# EAGLE design 1u_panel_v1.1 (EAGLE 7.7.0)
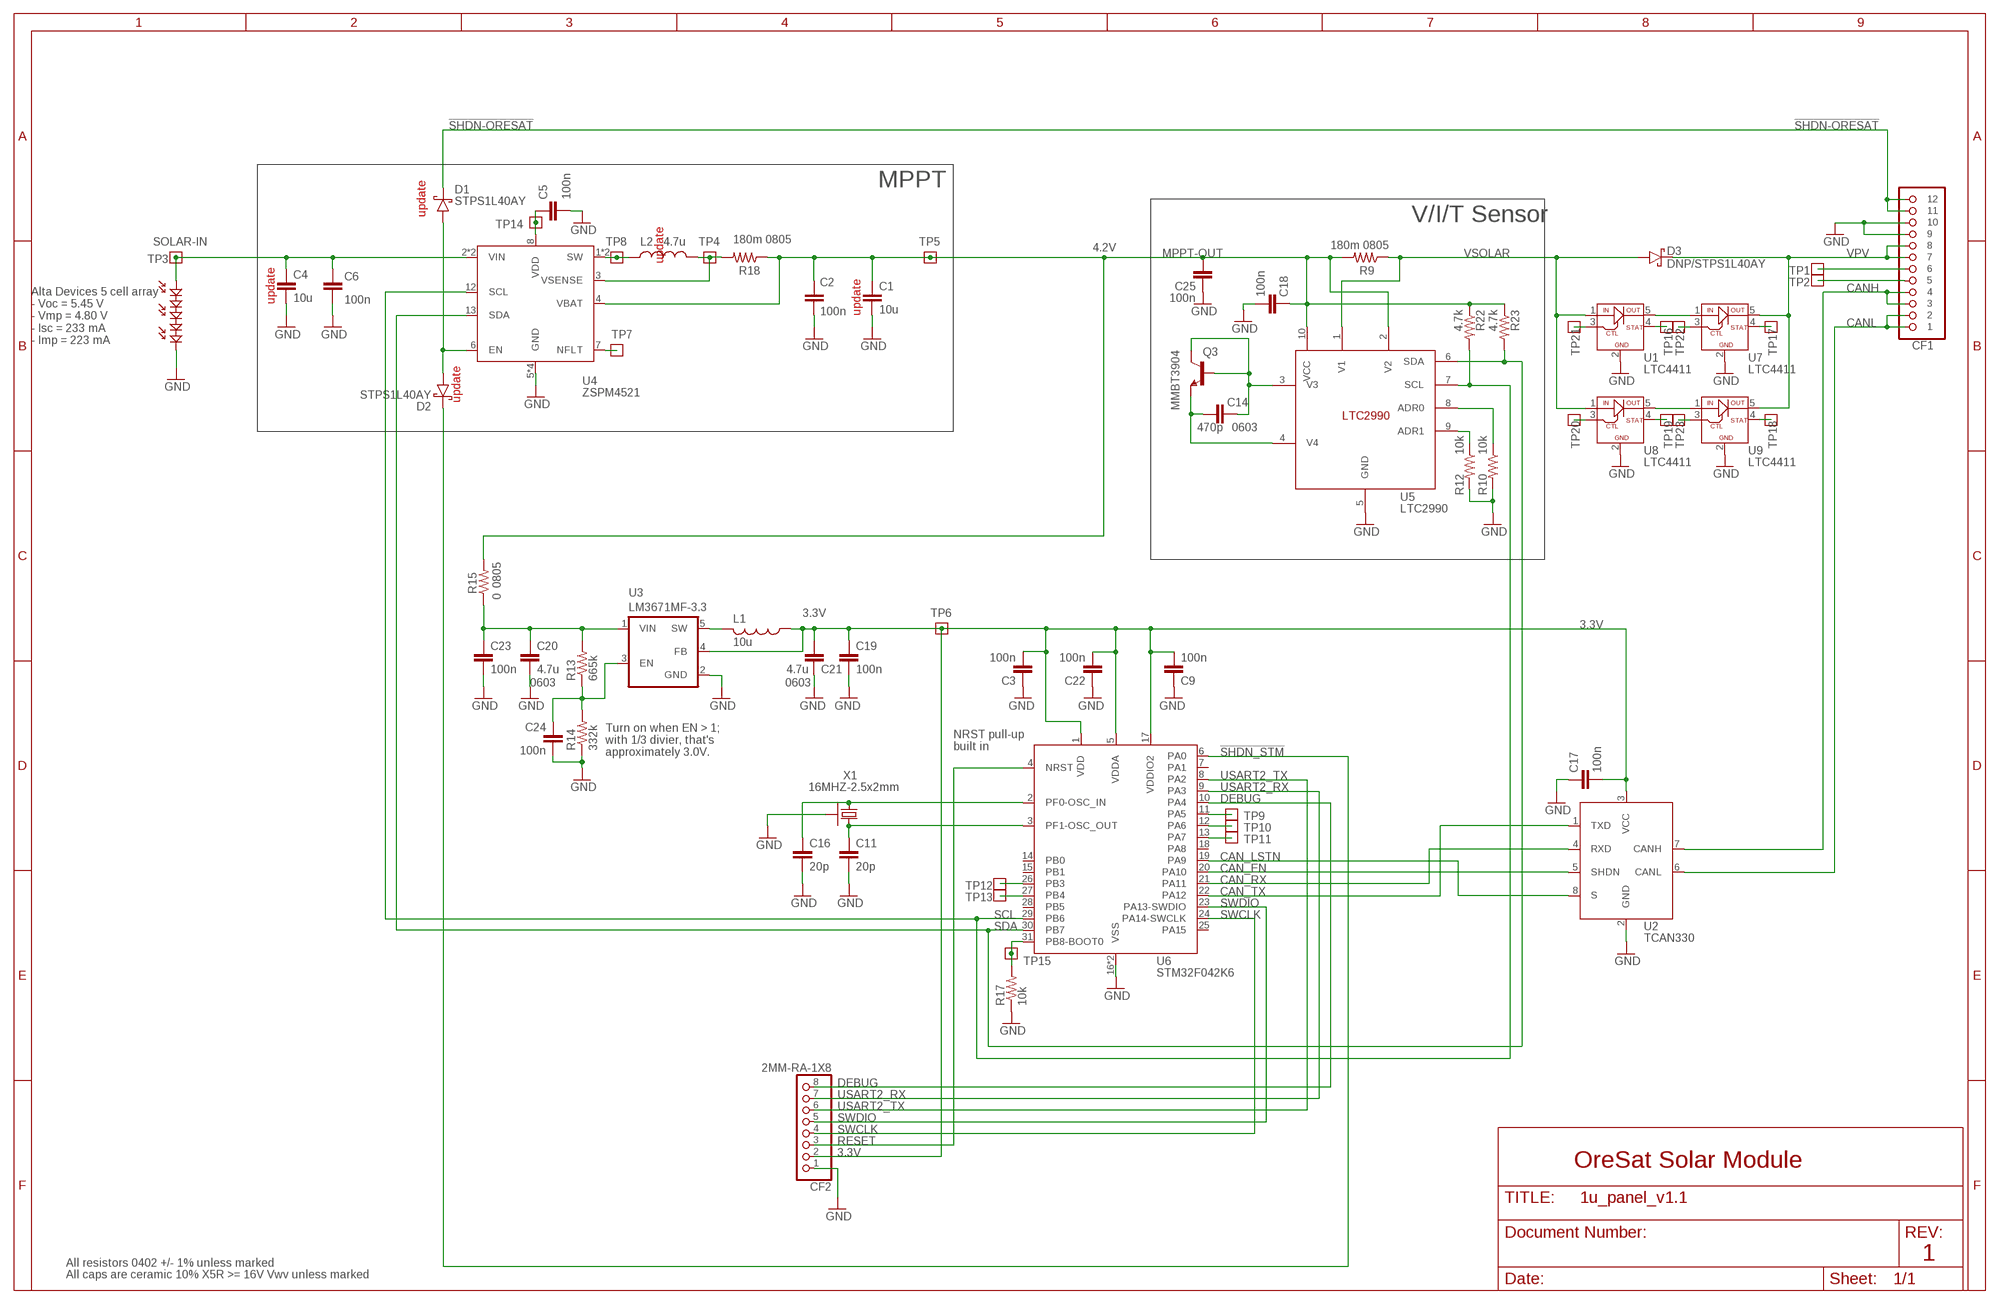
[diagram p0: schematic, sheet 1]

## Parts
C1  10u  C-EU1206-B  [1206-B]
C2  100n  C-EU0402-B-NOSILK  [.0402-B-NOSILK]
C3  100n  C-EU0402-B-NOSILK  [.0402-B-NOSILK]
C4  10u  C-EU1206-B  [1206-B]
C5  100n  C-EU0402-B-NOSILK  [.0402-B-NOSILK]
C6  100n  C-EU0402-B-NOSILK  [.0402-B-NOSILK]
C9  100n  C-EU0402-B-NOSILK  [.0402-B-NOSILK]
C11  20p  C-EU0402-B-NOSILK  [.0402-B-NOSILK]
C14  470p  C-EU0603-B-NOSILK  [.0603-B-NOSILK]
C16  20p  C-EU0402-B-NOSILK  [.0402-B-NOSILK]
C17  100n  C-EU0402-B-NOSILK  [.0402-B-NOSILK]
C18  100n  C-EU0402-B-NOSILK  [.0402-B-NOSILK]
C19  100n  C-EU0402-B-NOSILK  [.0402-B-NOSILK]
C20  4.7u  C-EUC0603  [C0603]
C21  4.7u  C-EUC0603  [C0603]
C22  100n  C-EU0402-B-NOSILK  [.0402-B-NOSILK]
C23  100n  C-EU0402-B-NOSILK  [.0402-B-NOSILK]
C24  100n  C-EU0402-B-NOSILK  [.0402-B-NOSILK]
C25  100n  C-EU0402-B-NOSILK  [.0402-B-NOSILK]
CF1  15220122401000  ORESAT-SOLARPANEL-12PIN  [CON-1.27-F-HARTING-1522012X601XXX]
CF2  2MM-RA-1X8  [CF-2MM-RA-1X8-PRECIDIP-831]
D1  STPS1L40AY  DIODE-DO214AC  [DO214AC]
D2  STPS1L40AY  DIODE-DO214AC  [DO214AC]
D3  DNP/STPS1L40AY  DIODE-DO214AC  [DO214AC]
L1  10u  L-USL2012C  [L2012C]
L2  4.7u  L-VISHAY-DALE-IFSC-1515AHER  [VISHAY-DALE-IFSR-1515AHER]
PV1  ALTA-5-CELL-ARRAYALTA-FIVE-CELL-SLOT  [ALTA-FIVE-CELL-THROUGH-SLOT]
Q3  MMBT3904  DIODE-INC-NPNSOT23HOLE  [SOT23HOLE]
R9  180m 0805  R-US_0805-B-NOSILK  [.0805-B-NOSILK]
R10  10k  R-US_0402-B-NOSILK  [.0402-B-NOSILK]
R12  10k  R-US_0402-B-NOSILK  [.0402-B-NOSILK]
R13  665k  R-US_0402-B-NOSILK  [.0402-B-NOSILK]
R14  332k  R-US_0402-B-NOSILK  [.0402-B-NOSILK]
R15  0  R-US_0805-B-NOSILK  [.0805-B-NOSILK]
R17  10k  R-US_0402-B-NOSILK  [.0402-B-NOSILK]
R18  180m 0805  R-US_0805-B-NOSILK  [.0805-B-NOSILK]
R22  4.7k  R-US_0402-B-NOSILK  [.0402-B-NOSILK]
R23  4.7k  R-US_0402-B-NOSILK  [.0402-B-NOSILK]
TP1  TEST-POINT  [2MM-TEST-POINT]
TP2  TEST-POINT  [2MM-TEST-POINT]
TP3  TEST-POINT  [2MM-TEST-POINT]
TP4  TEST-POINT  [2MM-TEST-POINT]
TP5  TEST-POINT  [2MM-TEST-POINT]
TP6  TEST-POINT  [2MM-TEST-POINT]
TP7  TEST-POINT  [2MM-TEST-POINT]
TP8  TEST-POINT  [2MM-TEST-POINT]
TP9  TEST-POINT  [2MM-TEST-POINT]
TP10  TEST-POINT  [2MM-TEST-POINT]
TP11  TEST-POINT  [2MM-TEST-POINT]
TP12  TEST-POINT  [2MM-TEST-POINT]
TP13  TEST-POINT  [2MM-TEST-POINT]
TP14  TEST-POINT  [2MM-TEST-POINT]
TP15  TEST-POINT  [2MM-TEST-POINT]
TP16  TEST-POINT  [2MM-TEST-POINT]
TP17  TEST-POINT  [2MM-TEST-POINT]
TP18  TEST-POINT  [2MM-TEST-POINT]
TP19  TEST-POINT  [2MM-TEST-POINT]
TP20  TEST-POINT  [2MM-TEST-POINT]
TP21  TEST-POINT  [2MM-TEST-POINT]
TP22  TEST-POINT  [2MM-TEST-POINT]
TP23  TEST-POINT  [2MM-TEST-POINT]
U1  LTC4411  [SOT23-5-B]
U2  TCAN330  [SOT23-8_TI-DCN]
U3  LM3671MF-3.3  LM3761  [SOT23-5]
U4  ZSPM4521  [QFN-16(4X4)]
U5  LTC2990  [MSOP10]
U6  STM32F042K6  [QFP32-7X7]
U7  LTC4411  [SOT23-5-B]
U8  LTC4411  [SOT23-5-B]
U9  LTC4411  [SOT23-5-B]
X1  16MHZ-2.5x2mm  CRYSTAL-WITH-GND  [CRYSTAL_2.5X2]

## Nets
3.3V: C3.2 C9.2 C17.2 C19.1 C21.1 C22.2 CF2.2 L1.1 TP6.1 U2.3(VCC) U3.4(FB) U6.1(VDD) U6.5(VDDA) U6.17(VDDIO2)
!SHDN-ORESAT: CF1.11 CF1.12 D1.C
!SHDN_STM: D2.C U6.6(PA0)
ADDRSELECT: R10.1 U5.8(ADR0)
ADR1: R12.1 U5.9(ADR1)
BOOT: R17.2 TP15.1 U6.31(PB8-BOOT0)
CAN_EN: U2.5(SHDN) U6.20(PA10)
CAN_LSTN: U2.8(S) U6.19(PA9)
CAN_RX: U2.4(RXD) U6.21(PA11)
CAN_TX: U2.1(TXD) U6.22(PA12)
CANH: CF1.3 CF1.4 U2.7(CANH)
CANL: CF1.1 CF1.2 U2.6(CANL)
CRYSTALIN: C16.1 U6.2(PF0-OSC_IN) X1.1
CRYSTALOUT: C11.1 U6.3(PF1-OSC_OUT) X1.3
DEBUG: CF2.8 U6.10(PA4)
GND: C1.2 C2.2 C3.1 C4.2 C5.2 C6.2 C9.1 C11.2 C16.2 C17.1 C18.2 C19.2 C20.2 C21.2 C22.1 C23.2 C24.2 C25.1 CF1.9 CF1.10 CF2.1 PV1.NEG1(NEG) PV1.NEG2(NEG) R10.2 R12.2 R14.1 R17.1 U1.2(GND) U2.2(GND) U3.2(GND) U4.5(GND) U4.15(GND) U4.16(GND) U4.PAD(GND) U5.5(GND) U6.16(VSS) U6.32(VSS) U7.2(GND) U8.2(GND) U9.2(GND) X1.2(SHIELD) X1.4(SHIELD)
MPPT-OUT: C1.1 C2.1 C18.1 C25.2 R9.2 R15.2 R18.1 R22.1 R23.1 TP5.1 U4.4(VBAT) U5.2(V2) U5.10(VCC)
N$1: C20.1 C23.1 R13.2 R15.1 U3.1(VIN)
N$2: L2.2 TP8.1 U4.1(SW) U4.14(SW)
N$3: CF1.6 TP1.1
N$4: CF1.5 TP2.1
N$5: L2.1 R18.2 TP4.1 U4.3(VSENSE)
N$6: TP9.1 U6.11(PA5)
N$7: TP10.1 U6.12(PA6)
N$8: TP11.1 U6.13(PA7)
N$9: TP12.1 U6.26(PB3)
N$10: TP13.1 U6.27(PB4)
N$11: C5.1 TP14.1 U4.8(VDD)
N$12: U1.5(OUT) U7.1(IN)
N$14: TP7.1 U4.7(NFLT)
N$15: U8.5(OUT) U9.1(IN)
N$16: TP16.1 U1.4(STAT)
N$17: TP23.1 U9.3(CTL)
N$18: TP17.1 U7.4(STAT)
N$19: TP18.1 U9.4(STAT)
N$20: TP19.1 U8.4(STAT)
N$21: TP22.1 U7.3(CTL)
N$22: TP21.1 U1.3(CTL)
N$23: TP20.1 U8.3(CTL)
RESET: CF2.3 U6.4(NRST)
SCL: R22.2 U4.12(SCL) U5.7(SCL) U6.29(PB6)
SDA: R23.2 U4.13(SDA) U5.6(SDA) U6.30(PB7)
SOLAR-IN: C4.1 C6.1 PV1.POS1(POS) PV1.POS2(POS) TP3.1 U4.2(VIN) U4.11(VIN)
STEPD: L1.2 U3.5(SW)
SWCLK: CF2.4 U6.24(PA14-SWCLK)
SWDIO: CF2.5 U6.23(PA13-SWDIO)
USART2_RX: CF2.7 U6.9(PA3)
USART2_TX: CF2.6 U6.8(PA2)
V3: C14.2 Q3.1(B) Q3.3(C) U5.3(V3)
V4: C14.1 Q3.2(E) U5.4(V4)
VDIV: C24.1 R13.1 R14.2 U3.3(EN)
VPV: CF1.7 CF1.8 D3.C U7.5(OUT) U9.5(OUT)
VSOLAR: D3.A R9.1 U1.1(IN) U5.1(V1) U8.1(IN)
ZSPM_EN: D1.A D2.A U4.6(EN)
Unconnected: U6.7(PA1) U6.14(PB0) U6.15(PB1) U6.18(PA8) U6.25(PA15) U6.28(PB5)

## Notes on the sheet
- MPPT
- update
- V/I/T Sensor
- 4.2V
- update
- update
- update
- Alta Devices 5 cell array
  - Voc = 5.45 V
  - Vmp = 4.80 V
  - Isc = 233 mA
  - Imp = 223 mA
- update
- 0603
- 0805
- 0603 | 0603
- NRST pull-up
  built in
- Turn on when EN > 1; 
  with 1/3 divier, that's
  approximately 3.0V.
- OreSat Solar Module
- 1
- All resistors 0402 +/- 1% unless marked
- All caps are ceramic 10% X5R >= 16V Vwv unless marked

## Library data of the parts
C1 C4 = rcl_custom:C-EU: CAPACITOR, European symbol; DIS: Digi-Key; DPN: 490-5309-1-ND; MFR: Murata; MPN: GRM31CR71A226KE15L
C2 C3 C5 C6 C9 C17-C19 C22-C25 = rcl_custom:C-EU: CAPACITOR, European symbol; DIS: Digi-Key; DPN: 1276-1001-1-ND; MFR: Samsung; MPN: CL05B104KO5NNNC
C11 C16 = rcl_custom:C-EU: CAPACITOR, European symbol; DIS: Digi-Key; DPN: 1276-6601-1-ND; MFR: Samsung; MPN: CL05C200JB51PNC
C14 = rcl_custom:C-EU: CAPACITOR, European symbol; DIS: Digi-Key; DPN: 1276-1274-1-ND; MFR: Samsung; MPN: CL10A226MP8NUNE
C20 C21 = rcl:C-EU: CAPACITOR, European symbol; DIS: Digi-Key; DPN: 1276-1001-1-ND; MFR: Samsung; MPN: CL05B104KO5NNNC
CF1 = oresat-eagle:ORESAT-SOLARPANEL-12PIN; DIS: Digi-Key; DPN: 1195-5663-1-ND; MFR: Harting; MPN: 15220122401000
CF2 = 2mm-RA-solar-module-debugging:2MM-RA-1X8; DIS: Digi-Key; DPN: 1212-1893-ND; MFR: PreciDip; MPN: 831-87-050-40-001101
D1-D3 = diode-schottkey:DIODE-: DIODE; DIS: Digi-Key; DPN: 497-12286-1-ND; MFR: ST; MPN: STPS1L40AY
L1 = rcl:L-US: INDUCTOR, American symbol; DIS: Digi-Key; DPN: 587-2452-1-ND; MFR: Taiyo Yuden; MPN: CB2012T100KR
L2 = ind-vishay-dale-IFSC-1515AHER:L-VISHAY-DALE-IFSC-1515AHER; DIS: Digi-Key; DPN: 541-1407-1-ND; MFR: Vishay Dale; MPN: IFSC1515AHER220M01
PV1 = alta-cell:ALTA-5-CELL-ARRAY
Q3 = diodes-inc-npn:DIODE-INC-NPN; DIS: Digi-Key; DPN: MMBT3904FSCT-ND; MFR: Fairchild/ON Semiconductor; MPN: MMBT3904
R9 R18 = rcl_custom:R-US_: RESISTOR, American symbol; DIS: Digi-Key; DPN: 541-2730-1-ND; MFR: Vishay Dale; MPN: RCWE0805R180FKEA
R10 R12 = rcl_custom:R-US_: RESISTOR, American symbol; DIS: Digi-Key; DPN: RHM10.0KLCT-ND; MFR: Rohm Semiconductor; MPN: MCR01MZPF1002
R13 R17 = rcl_custom:R-US_: RESISTOR, American symbol; DIS: Digi-Key; DPN: 1276-4275-1-ND; MFR: Samsung; MPN: RC1005F6653CS
R14 = rcl_custom:R-US_: RESISTOR, American symbol; DIS: Digi-Key; DPN: 1276-4245-1-ND; MFR: Samsung; MPN: RC1005F3323CS
R15 = rcl_custom:R-US_: RESISTOR, American symbol; DIS: Digi-Key; DPN: RHM0.0ARCT-ND; MFR: Rohm; MPN: MCR10EZPJ000
R22 R23 = rcl_custom:R-US_: RESISTOR, American symbol; DIS: Digi-Key; DPN: RHM4.7KBHCT-ND; MFR: Rohm Semiconductor; MPN: TRR01MZPF4701
TP1-TP23 = Tova:TEST-POINT
U1 U7-U9 = ltc4411:LTC4411
U2 = TCAN330:TCAN330; DIS: Digi-Key; DPN: 296-44211-1-ND; MFR: Texas Instruments; MPN: TCAN330GDCNT
U3 = LM3761:LM3761: http://www.digikey.com/product-detail/en/texas-instruments/LM3671MF-3.3-NOPB/LM3671MF-3.3-NOPBCT-ND/1590190; DIS: Digi-Key; DPN: LM3671MF-3.3/NOPBCT-ND; MFR: TI; MPN: LM3671MF-3.3/NOPB
U4 = ZSPM4521:ZSPM4521
U5 = LTC2990:LTC2990; DIS: Digi-Key; DPN: LTC2990CMS#PBF-ND; MFR: Linear Technology; MPN: LTC2990CMS#PBF
U6 = STM32F042K:STM32F042K6; DIS: Digi-Key; DPN: STM32F042K6T7-ND; MFR: STMicroelectronics; MPN: STM32F042K6T7
X1 = low-gain-radio:CRYSTAL-WITH-GND; DIS: Digi-Key; DPN: XC2181CT-ND; MFR: ECS Inc.; MPN: ECS-160-10-36Q-ES-TR

## Board
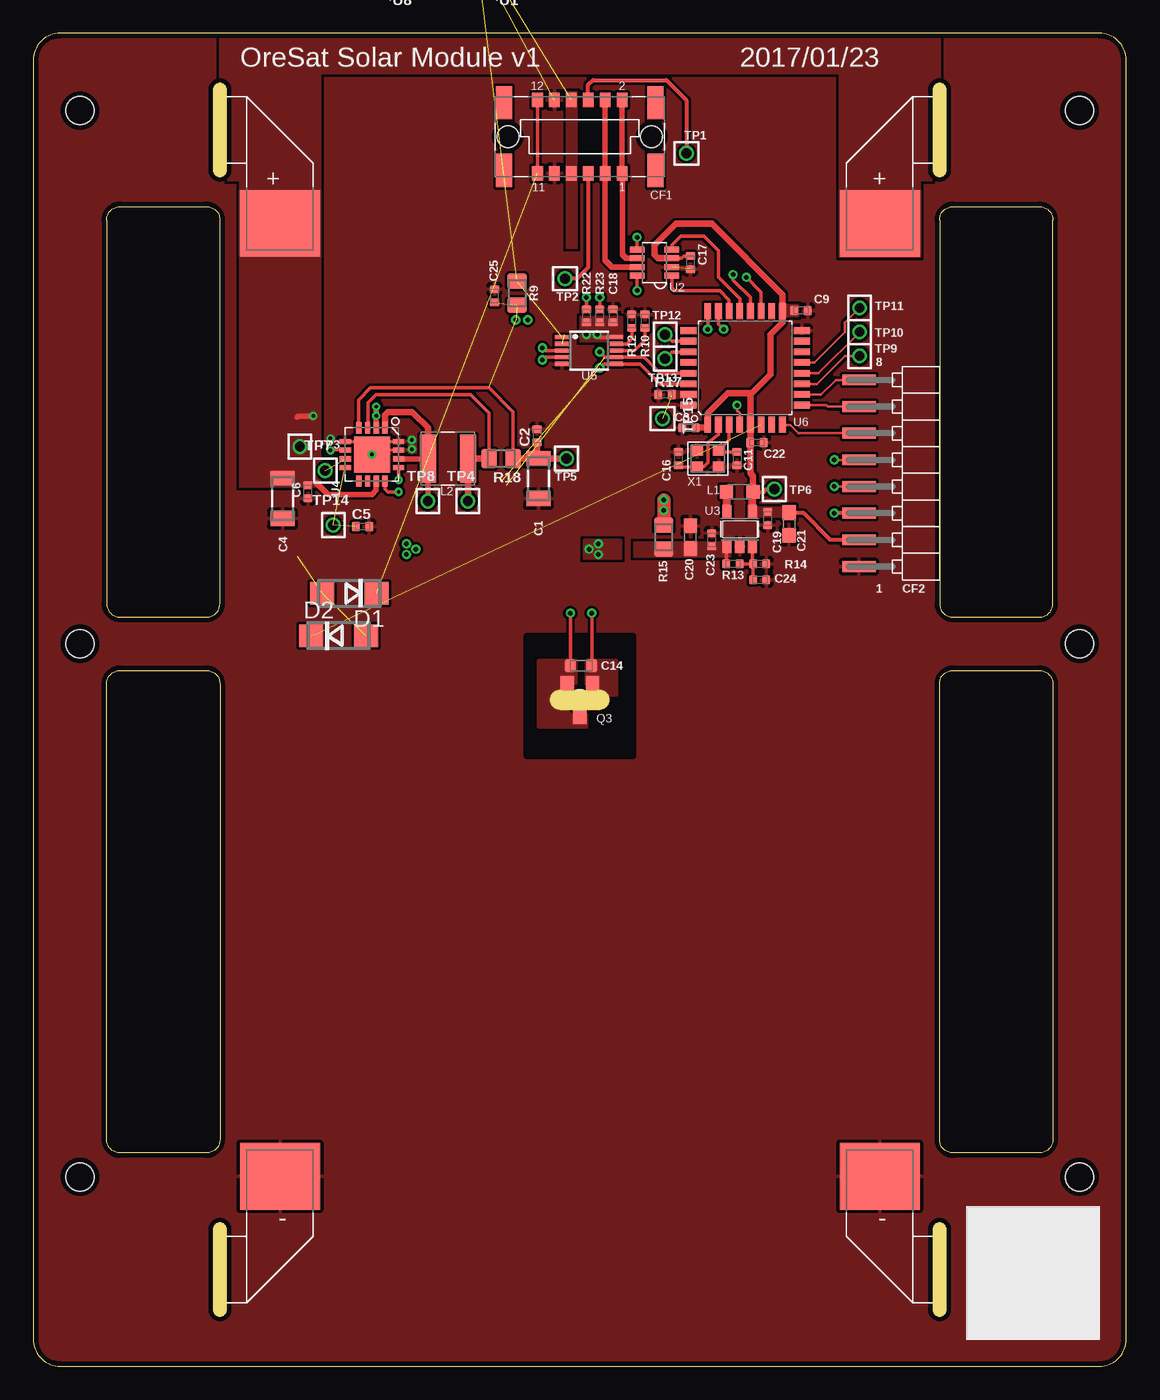
[diagram p1: board, top side]
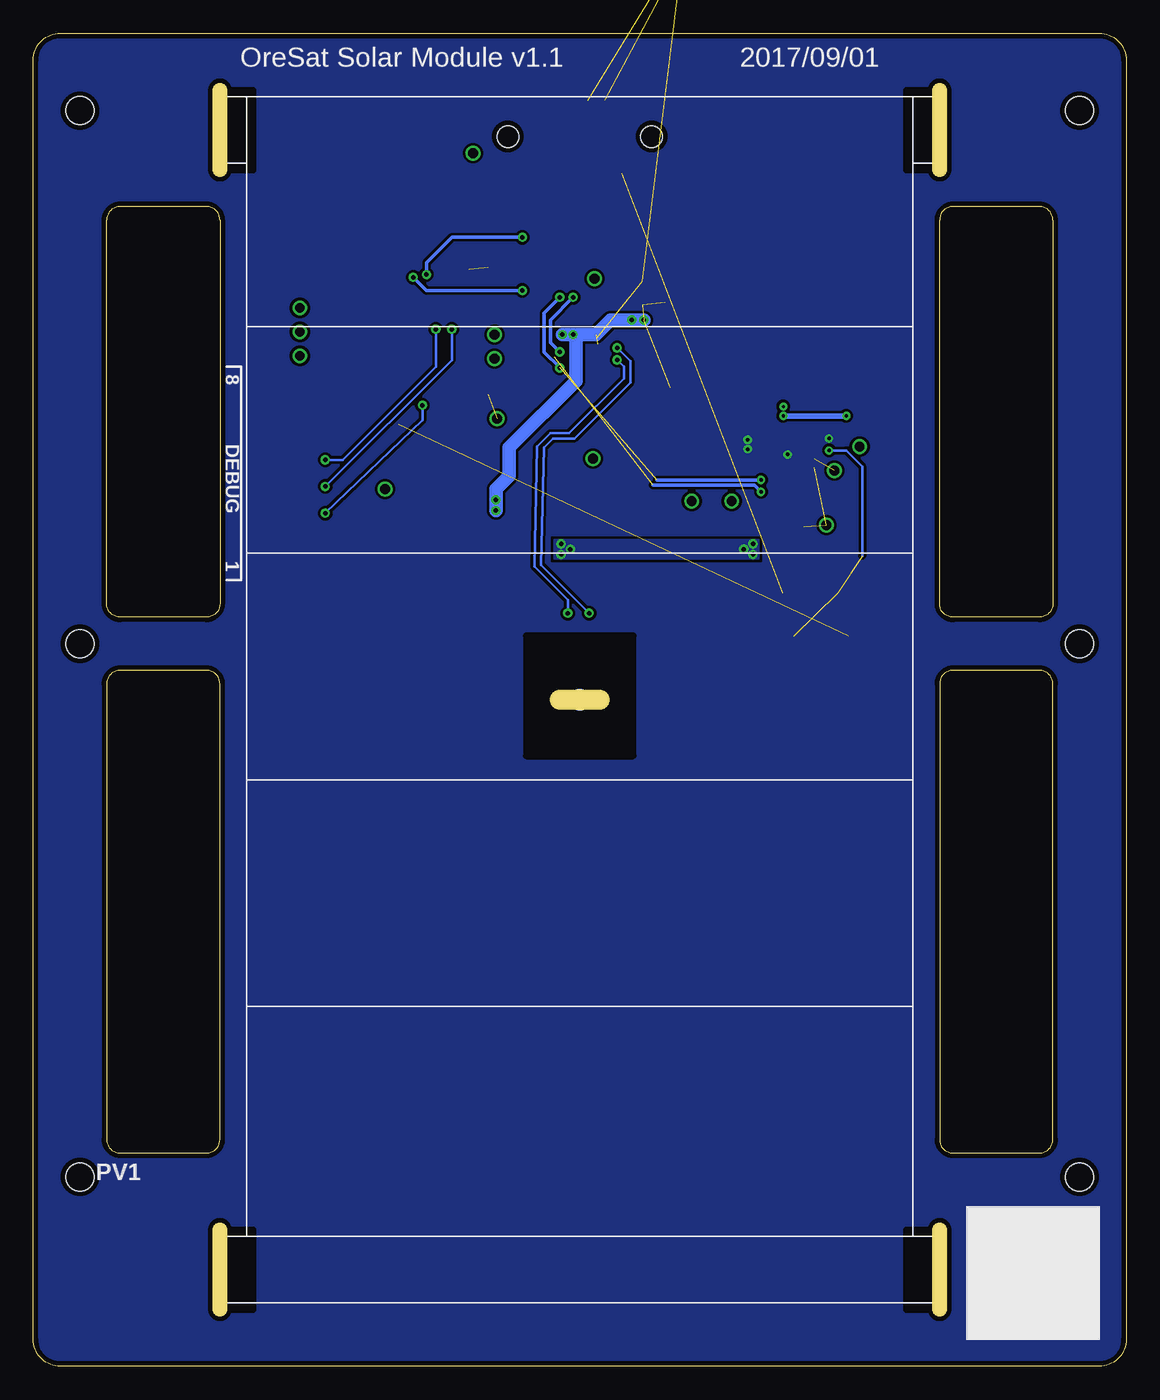
[diagram p2: board, bottom side, seen from below]

Size 82 x 100 mm. Coordinates in mm from the lower left corner, seen from the top.
Outline: 80,100 2,100 arc90 0,98 0,2 arc90 2,0 80,0 arc90 82,2 82,98 arc90 80,100
Outline: 6.5,56.2 13,56.2 arc90 14,57.2 14,86 arc90 13,87 6.5,87 arc90 5.5,86 5.5,57.2 arc90 6.5,56.2
Outline: 5.5,17 5.5,51.2 arc-90 6.5,52.2 13,52.2 arc-90 14,51.2 14,17 arc-90 13,16 6.5,16 arc-90 5.5,17
Outline: 69,56.2 75.5,56.2 arc90 76.5,57.2 76.5,86 arc90 75.5,87 69,87 arc90 68,86 68,57.2 arc90 69,56.2
Outline: 68,17 68,51.2 arc-90 69,52.2 75.5,52.2 arc-90 76.5,51.2 76.5,17 arc-90 75.5,16 69,16 arc-90 68,17
Outline: 68,89.25 arc90 68.5,89.75 68.5,95.75 arc90 68,96.25 arc90 67.5,95.75 67.5,89.75 arc90 68,89.25
Outline: 14.5,89.75 14.5,95.75 arc90 14,96.25 arc90 13.5,95.75 13.5,89.75 arc90 14,89.25 arc90 14.5,89.75
Outline: 14.5,4.25 14.5,10.25 arc90 14,10.75 arc90 13.5,10.25 13.5,4.25 arc90 14,3.75 arc90 14.5,4.25
Outline: 68.5,4.25 68.5,10.25 arc90 68,10.75 arc90 67.5,10.25 67.5,4.25 arc90 68,3.75 arc90 68.5,4.25
Copper layers (1*16): Top 0.0356mm / dielectric 1.5011mm / Bottom 0.0356mm
Design rules "OSH-Park-2-layer *": minimum track width 6mil, minimum drill 13mil, track to track 6mil, track to pad 6mil, pad to pad 6mil, via to via 6mil, smd to smd 6mil, copper to edge 15mil, drill to drill 6mil, minimum pad ring 7mil, minimum via ring 7mil, stop-mask expansion 3mil, vias tented up to drill 13mil, thermal gap 10mil
Holes 2.1 mm at 3.5,14.2 3.5,54.2 3.5,94.2 78.5,14.2 78.5,54.2 78.5,94.2
tKeepout: area 0,0 to 82,100
tRestrict: 6 lines
bRestrict: 4 lines
Milling: 1 lines

### Footprints (pad centres in the part's own frame; a part is rotated, then mirrored left to right if it is on the bottom)
1206-B = smd 1.15 x 1.8: 1 -1.5,0; 2 1.5,0
.0402-B-NOSILK = smd 0.6 x 0.7: 1 -0.5,0; 2 0.5,0
.0603-B-NOSILK = smd 0.8 x 0.95: 1 -0.8,0; 2 0.8,0
C0603 = smd 1.1 x 1: 1 -0.85,0; 2 0.85,0
CON-1.27-F-HARTING-1522012X601XXX = smd 0.8 x 1.1: 1 3.175,-2.75; 2 3.175,2.75; 3 1.905,-2.75; 4 1.905,2.75; 5 0.635,-2.75; 6 0.635,2.75; 7 -0.635,-2.75; 8 -0.635,2.75; 9 -1.905,-2.75; 10 -1.905,2.75; 11 -3.175,-2.75; 12 -3.175,2.75 | smd 1.2 x 2.5: P$1 -5.685,-2.55; P$2 -5.685,2.55; P$3 5.685,2.55; P$4 5.685,-2.55 | hole 1.6: -5.385,0; 5.385,0
CF-2MM-RA-1X8-PRECIDIP-831 = smd 2.5 x 0.8: 1 -3.25,-7; 2 -3.25,-5; 3 -3.25,-3; 4 -3.25,-1; 5 -3.25,1; 6 -3.25,3; 7 -3.25,5; 8 -3.25,7
DO214AC = smd 1.8 x 1.7: A 2.05,0; C -2.05,0
L2012C = smd 1 x 1: 1 -1,0; 2 1,0
VISHAY-DALE-IFSR-1515AHER = smd 3.6 x 1.2: 1 0,1.5; 2 0,-1.5
ALTA-FIVE-CELL-THROUGH-SLOT = smd 6 x 5 bottom: NEG1 -22.5,35.75; NEG2 22.5,35.75; POS1 -22.5,-35.75; POS2 22.5,-35.75
SOT23HOLE = smd 1 x 1.4: 1 0.95,-1.1; 2 -0.95,-1.1; 3 0,1.1 | hole 1.5: 0,0
.0805-B-NOSILK = smd 1.15 x 1.45: 1 -0.9,0; 2 0.9,0
2MM-TEST-POINT = drill 0.737: 1 0,0
SOT23-5-B = smd 0.6 x 1.05: 1 0.95,1.35; 2 0,1.35; 3 -0.95,1.35; 4 -0.95,-1.35; 5 0.95,-1.35
SOT23-8_TI-DCN = smd 0.45 x 1.1: 1 -0.975,-1.3; 2 -0.325,-1.3; 3 0.325,-1.3; 4 0.975,-1.3; 5 0.975,1.3; 6 0.325,1.3; 7 -0.325,1.3; 8 -0.975,1.3
SOT23-5 = smd 0.69 x 0.99: 1 -0.95,-1.29; 2 0,-1.29; 3 0.95,-1.29; 4 0.95,1.3; 5 -0.95,1.3
QFN-16(4X4) = smd 0.85 x 0.4: 1 -2,0.975; 2 -2,0.325; 3 -2,-0.325; 4 -2,-0.975; 9 2,-0.975; 10 2,-0.325; 11 2,0.325; 12 2,0.975 | smd 0.4 x 0.85: 5 -0.975,-2; 6 -0.325,-2; 7 0.325,-2; 8 0.975,-2; 13 0.975,2; 14 0.325,2; 15 -0.325,2; 16 -0.975,2 | smd 2.7 x 2.7: PAD 0,0
MSOP10 = smd 0.3 x 1: 1 -1,-2.05; 2 -0.5,-2.05; 3 0,-2.05; 4 0.5,-2.05; 5 1,-2.05; 6 1,2.05; 7 0.5,2.05; 8 0,2.05; 9 -0.5,2.05; 10 -1,2.05
QFP32-7X7 = smd 1.2 x 0.5: 1 -4.25,2.8; 2 -4.25,2; 3 -4.25,1.2; 4 -4.25,0.4; 5 -4.25,-0.4; 6 -4.25,-1.2; 7 -4.25,-2; 8 -4.25,-2.8; 17 4.25,-2.8; 18 4.25,-2; 19 4.25,-1.2; 20 4.25,-0.4; 21 4.25,0.4; 22 4.25,1.2; 23 4.25,2; 24 4.25,2.8 | smd 0.5 x 1.2: 9 -2.8,-4.25; 10 -2,-4.25; 11 -1.2,-4.25; 12 -0.4,-4.25; 13 0.4,-4.25; 14 1.2,-4.25; 15 2,-4.25; 16 2.8,-4.25; 25 2.8,4.25; 26 2,4.25; 27 1.2,4.25; 28 0.4,4.25; 29 -0.4,4.25; 30 -1.2,4.25; 31 -2,4.25; 32 -2.8,4.25
CRYSTAL_2.5X2 = smd 0.9 x 0.8: 1 -0.825,-0.625; 2 0.825,-0.625; 3 0.825,0.625; 4 -0.825,0.625

### Placement (x,y rotation side)
C1  37.9,66.6 270 top
C2  37.8,69.8 90 top
C3  49.2,70.4 0 top
C4  18.7,65.1 270 top
C5  24.7,63 0 top
C6  20.6,65.6 270 top
C9  57.6,79.2 180 top
C11  52.8,68.1 270 top
C14  41.1,52.55 180 top
C16  48.4,68.1 90 top
C17  49.3,82.8 90 top
C18  43.5,78.8 90 top
C19  55.1,63.6 270 top
C20  49.3,62.2 90 top
C21  56.7,63.2 270 top
C22  54.3,69.3 180 top
C23  50.9,62 90 top
C24  54.5,59 0 top
C25  34.6,80.3 270 top
CF1  41,92.25 0 top
CF2  65.2,67 0 top
D1  23.7,58 180 top
D2  22.9,54.8 0 top
D3  31.5,107.5 270 top  (outside the outline)
L1  53,65.6 180 top
L2  31.1,68.1 270 top
PV1  41,50 180 bottom
Q3  41,50 180 top
R9  36.3,80.5 270 top
R10  45.9,78.4 90 top
R12  44.9,78.4 90 top
R13  52.5,60.2 180 top
R14  54.5,60.2 180 top
R15  47.3,62.2 90 top
R17  47.4,72.9 0 top
R18  35.1,68.1 180 top
R22  41.5,78.8 90 top
R23  42.5,78.8 90 top
TP1  49,91 90 top
TP2  39.9,81.6 90 top
TP3  20,69 0 top
TP4  32.6,64.9 0 top
TP5  40,68.1 0 top
TP6  55.6,65.8 0 top
TP7  21.9,67.2 0 top
TP8  29.6,64.9 0 top
TP9  62,75.8 0 top
TP10  62,77.6 0 top
TP11  62,79.4 0 top
TP12  47.4,77.4 0 top
TP13  47.4,75.6 0 top
TP14  22.5,63.1 0 top
TP15  47.2,71.1 270 top
TP16  37,106 90 top  (outside the outline)
TP17  37,111 90 top  (outside the outline)
TP18  29,111 90 top  (outside the outline)
TP19  29,106 90 top  (outside the outline)
TP20  29,104 90 top  (outside the outline)
TP21  37,104 90 top  (outside the outline)
TP22  37,109 90 top  (outside the outline)
TP23  29,109 90 top  (outside the outline)
U1  34.5,105 180 top  (outside the outline)
U2  46.6,82.8 90 top
U3  53,62.8 0 top
U4  25.4,68.4 270 top
U5  41.71,76.2 270 top
U6  53.4,74.9 90 top
U7  34.5,110 180 top  (outside the outline)
U8  26.5,105 180 top  (outside the outline)
U9  26.5,110 180 top  (outside the outline)
X1  50.6,68.1 0 top

### Tracks (layer width: path | path; a pad name or v marks a point on that pad's centre or on a via)
3.3V
  Top 0.254: U2.3 48.62,83.12 48.8,83.3 C17.2
  Top 0.3: CF2.2 59.8,62 57.8,64 56.75,64 C21.1 | L1.1 54.8,65.6 55,65.8 TP6.1
  Top 0.5: U2.3 46.88,83.12 46.6,83.4 46.6,84.1 48.2,85.7 50.9,85.7 56.2,80.4 U6.17 56.2,78.3 55.3,77.4 55.3,74.4 53.9,73 53.8,73 | 53.8,73 52.1,73 50.6,71.5 U6.1 50.6,70.4 C3.2 | 53.8,73 U6.5 C22.2 53.8,67 54,66.8 L1.1
  Top 0.6: U3.4 53.95,65.45 L1.1
  pour Top (isolate 0.25, no thermals): 57.05,63.7 53.7,63.7 53.7,64.45 57.05,64.45
  pour Top (no thermals): 56.1,79.6 56.1,78.8 57.4,78.8 57.4,79.6
!SHDN-ORESAT  (1 unrouted)
  Top 0.25: CF1.12 CF1.11
!SHDN_STM  (1 unrouted)
ADDRSELECT
  Top 0.25: R10.1 45.9,77 45.1,76.2 U5.8
ADR1
  Top 0.25: R12.1 44.9,77.1 44.5,76.7 U5.9
BOOT  (1 unrouted)
  pour Top (no thermals): 49.7,72.8 48.1,72.8 48.1,72.7 47.8,72.7 47.8,73.1 48.1,73.1 48.1,73 49.7,73 49.7,72.9
CAN_EN  (via drill 0.33)
  Top 0.25: v52.5,81.9 52.5,81.5 53.8,80.2 U6.20 | U2.5 v45.3,84.7
  Bottom 0.25: v52.5,81.9 52.5,82.8 50.6,84.7 v45.3,84.7
CAN_LSTN  (via drill 0.33)
  Top 0.25: v45.3,80.7 U2.8 | v53.5,81.7 54.6,80.6 U6.19
  Bottom 0.25: v53.5,81.7 52.5,80.7 v45.3,80.7
CAN_RX
  Top 0.25: U2.4 47.9,84.1 48.6,84.8 50.3,84.8 51.4,83.7 51.4,81.7 53,80.1 U6.21
CAN_TX
  Top 0.25: U2.1 47.9,80.9 48.1,80.7 51.5,80.7 52.2,80 U6.22
CANH
  Top 0.4: U2.7 43.42,82.47 42.9,83 42.91,83 CF1.3
  Top 0.406: CF1.3 CF1.4
CANL
  Top 0.4: U2.6 44.48,83.12 44.2,83.4 44.2,89.47
  Top 0.406: 44.2,89.47 CF1.1 CF1.2
CRYSTALIN
  Top 0.25: C16.1 48.52,67.47 X1.1 49.8,67.5 50.3,67.5 50.6,67.8 50.6,69.3 51.4,69.9 U6.2
CRYSTALOUT
  Top 0.25: U6.3 52.2,69.5 X1.3 51.55,68.6 C11.1
DEBUG
  Top 0.2: U6.10 59.1,72.9 60.2,74 CF2.8
GND  (via drill 0.25)  (5 unrouted)
  Top 0.2: U4.15 25.73,68.72 U4.PAD | U4.16 26.38,69.38 U4.PAD | U4.5 24.43,69.38 U4.PAD
  other vias: 25.4,68.4 22.3,69.6 28.4,68.8 28.4,69.5
  pour Bottom (isolate 0.2, rank 6): 80,0 2,0 arc-90 0,2 0,98 arc-90 2,100 80,100 arc-90 82,98 82,2 arc-90
  pour Top (isolate 0.2, rank 6): 80,0 2,0 arc-90 0,2 0,98 arc-90 2,100 80,100 arc-90 82,98 82,2 arc-90
MPPT-OUT  (via drill 0.33)  (4 unrouted)
  Top 0.25: R18.1 36,71.6 34.2,73.4 25.3,73.4 24.4,72.5 24.4,70.42 U4.4
  Top 0.3: 42.5,77.2 U5.10
  Top 0.5: R18.1 C1.1 | C2.1 37.8,68.2 C1.1 | TP5.1 C1.1
  Top 1: R15.2 v47.3,64.2 v47.3,65
  Bottom 1: v36.2,78.5 v37.1,78.5 38.7,78.5 39.8,77.4 41.3,77.4 | v42.3,77.4 41.3,77.4 | 41.3,77.4 41.3,73.9 46.3,68.9 46.3,66.8 47.3,65.8 v47.3,65 v47.3,64.2
  other vias: 41.5,77.4
  pour Top (isolate 0.2, no thermals): 41,76.9 44.2,76.9 44.2,78.7 41,78.7
N$1
  Top 0.25: R13.2 52,61.46
  Top 0.5: 52,61.46 U3.1
  pour Top (isolate 0.2, no thermals): 52.25,60.7 45.1,60.7 45.1,61.85 52.25,61.85
N$2
  Top 0.4: U4.14 29.57,68.08 L2.2 29.6,67.9 TP8.1
  Top 0.5: U4.1 26.38,71.38 26.6,71.6 28.4,71.6 29.6,70.4 29.6,67.9
N$3
  Top 0.3: CF1.6 41.63,96.14 42,96.5 47.5,96.5 49,95 TP1.1
N$4
  Top 0.3: CF1.5 41.63,82.44 40.8,81.6 TP2.1
N$5
  Top 0.25: R18.2 34.2,71.5 32.8,72.9 25.7,72.9 25.1,72.3 25.1,70.42 U4.3
  Top 0.5: R18.2 L2.1 TP4.1
N$6
  Top 0.2: U6.11 58.8,73.7 60.9,75.8 TP9.1
N$7
  Top 0.2: U6.12 58.9,74.5 TP10.1
N$8
  Top 0.2: U6.13 58.6,75.3 60.9,77.6 60.9,78.3 TP11.1
N$9
  Top 0.25: U6.26 47.9,76.9 TP12.1
N$10
  Top 0.25: U6.27 47.9,76.1 TP13.1
N$11  (2 unrouted)
N$12  (1 unrouted)
N$14  (1 unrouted)
N$15  (1 unrouted)
N$16  (1 unrouted)
N$17  (1 unrouted)
N$18  (1 unrouted)
N$19  (1 unrouted)
N$20  (1 unrouted)
N$21  (1 unrouted)
N$22  (1 unrouted)
N$23  (1 unrouted)
RESET  (via drill 0.33)
  Top 0.2: U6.4 53,71.5 52.8,71.7 v52.8,72.1
  Top 0.3: CF2.3 v60.1,64
  Bottom 0.2: v52.8,72.1 52.8,71 v60.1,64
SCL  (via drill 0.25, 0.33, 0.33 pad 0.25)  (1 unrouted)
  Top 0.25: v41.5,80.2 41.5,79.5 | v42.5,76.1 42.9,75.7 U5.7 45.8,75.7 47,74.5 U6.29 | U4.12 26.38,65.83 26.6,65.6 v27.4,65.6
  Top 0.406: 41.5,79.5 R22.2
  Bottom 0.25: v42.5,76.1 43.2,76.8 43.2,78.5 v41.5,80.2 | v27.4,65.6 27.9,66.1 35.5,66.1
SDA  (via drill 0.25, 0.33)  (1 unrouted)
  Top 0.25: v42.5,80.2 42.5,79.5 | v42.5,74.9 42.8,75.2 U5.6 45.5,75.2 47,73.7 U6.30 | U4.13 v27.4,66.5
  Top 0.406: 42.5,79.5 R23.2
  Bottom 0.25: v42.5,74.9 43.7,76.1 43.7,79 v42.5,80.2 | v27.4,66.5 35.2,66.5
SOLAR-IN  (via drill 0.25)
  Top 0.4: U4.11 25.73,65.72 25.4,65.4 22.1,65.4 21.2,66.3 | U4.2 v25.73,71.3 v25.73,72 | v21,71.3 19.9,71.3 19.8,71.2
  Bottom 0.4: v25.73,71.3 v21,71.3
  pour Top (isolate 0.2, no thermals): 68,100 14,100 14,89 15.5,89 15.5,66 21.5,66 21.5,97 60.5,97 60.5,83.25 66.5,83.25 66.5,89 68,89
SOLAR-IN-SWITCHED  (via drill 0.33)
  other vias: 42.4,61.7 42.4,60.9 41.7,61.3 28.7,61.3 28,61.7 28,60.9
  pour Top (no thermals): 44.1,60.6 44.1,62 41.3,62 41.3,60.6
  pour Bottom: 42.9,60.6 42.9,62 27.6,62 27.6,60.6
STEPD
  Top 0.6: U3.5 52.05,65.45 L1.2
SWCLK  (via drill 0.33)
  Top 0.2: CF2.4 v60.1,66
  Top 0.25: U6.24 v50.6,77.8
  Bottom 0.2: v60.1,66 50.6,75.5 v50.6,77.8
SWDIO  (via drill 0.33)
  Top 0.2: CF2.5 v60.1,68
  Top 0.25: U6.23 51.4,78.2 v51.8,77.8
  Bottom 0.2: v51.8,77.8 51.8,75 58.8,68 v60.1,68
USART2_RX
  Top 0.2: U6.9 59.5,72.1 59.6,72 CF2.7
USART2_TX
  Top 0.2: CF2.6 57.4,70 56.8,70.6 56.25,70.6 U6.8
V3  (via drill 0.33 pad 0.5)
  Top 0.25: C14.2 v40.3,56.5 | U5.3 38.4,76.2 v38.2,76.4
  Bottom 0.2: v40.3,56.5 43.9,60.1 43.7,68.9 43,69.6 41.4,69.6 37.2,73.8 37.2,75.4 v38.2,76.4
  pour Top (no thermals): 41.5,47.95 41.5,49.5 40.7,49.5 40.7,52.95 37.9,52.95 37.9,47.95
V4  (via drill 0.33 pad 0.5)
  Top 0.25: C14.1 v41.9,56.5 | U5.4 38.4,75.7 v38.2,75.5
  Bottom 0.2: v41.9,56.5 41.9,57.5 44.4,60 44.2,69 43.2,70 41.8,70 37.7,74.1 37.7,75 v38.2,75.5
  pour Top (no thermals): 41.5,52.95 41.5,50.35 43.75,50.35 43.75,52.95
VDIV
  Top 0.25: U3.3 53.95,60.2 | 53.95,60.2 R13.1 | 53.95,60.2 R14.2 C24.1
VPV  (3 unrouted)
  pour Top (isolate 0.2, no thermals): 40,83.9 40.8,83.9 40.8,95.6 40,95.6
VSOLAR  (4 unrouted)
ZSPM_EN  (via drill 0.25)  (2 unrouted)
  Top 0.2: U4.6 22.32,68.72 v22.3,68.7
  Bottom 0.2: v22.3,68.7 21,68.7 19.8,67.5 19.8,60.8

### Text on the board
tPlace: OreSat Solar Module v1 | 2017/01/23
bPlace: 2017/09/01 | OreSat Solar Module v1.1 | 8 | DEBUG | 1
tDimensions: x6 | Internal radii = 1 mm / External radii = 2 mm